# Altium schematic sheet ADC_Mod_1.SchDoc
size Letter
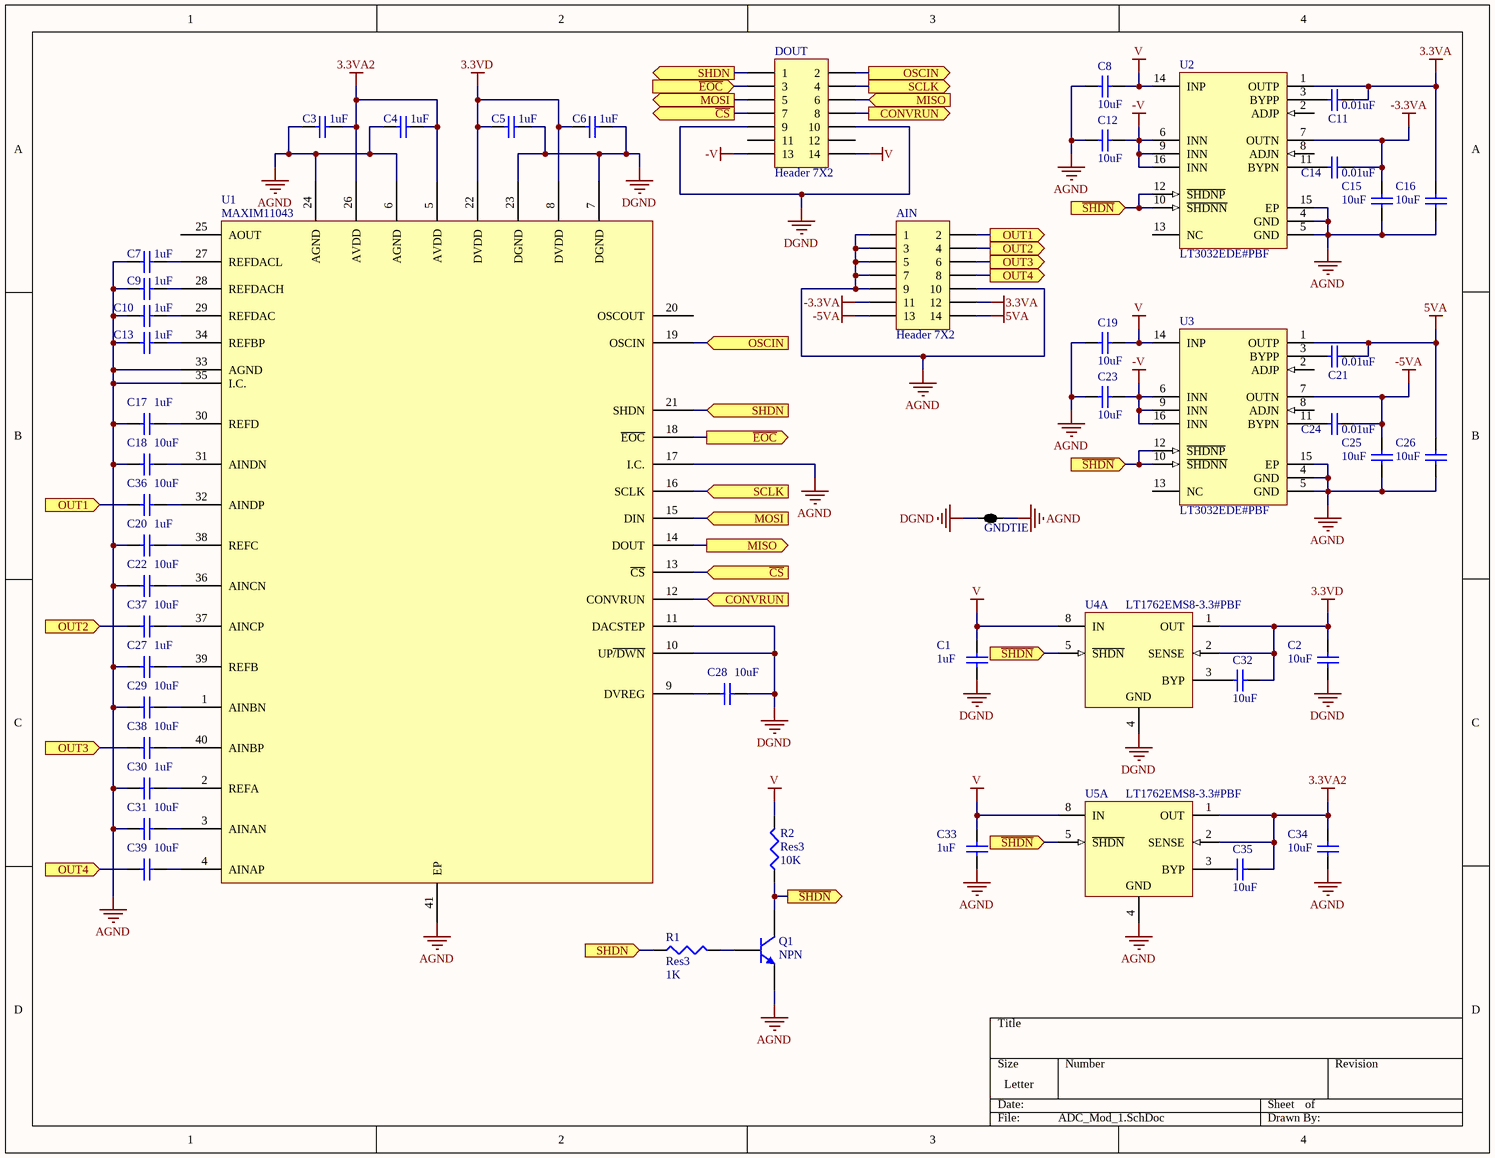
[diagram p0: ADC_Mod_1.SchDoc]

## Parts
AIN  Header 7X2  [CLP-107-02-L-DH-TR]
C1  value 1uF  [0402]  (hidden comment: Cap)
C2  value 10uF  [0402]  (hidden comment: Cap)
C3  value 1uF  [0402]  (hidden comment: Cap)
C4  value 1uF  [0402]  (hidden comment: Cap)
C5  value 1uF  [0402]  (hidden comment: Cap)
C6  value 1uF  [0402]  (hidden comment: Cap)
C7  value 1uF  [0402]  (hidden comment: Cap)
C8  value 10uF  [0402]  (hidden comment: Cap)
C9  value 1uF  [0402]  (hidden comment: Cap)
C10  value 1uF  [0402]  (hidden comment: Cap)
C11  value 0.01uF  [0402]  (hidden comment: Cap)
C12  value 10uF  [0402]  (hidden comment: Cap)
C13  value 1uF  [0402]  (hidden comment: Cap)
C14  value 0.01uF  [0402]  (hidden comment: Cap)
C15  value 10uF  [0402]  (hidden comment: Cap)
C16  value 10uF  [0402]  (hidden comment: Cap)
C17  value 1uF  [0402]  (hidden comment: Cap)
C18  value 10uF  [0402]  (hidden comment: Cap)
C19  value 10uF  [0402]  (hidden comment: Cap)
C20  value 1uF  [0402]  (hidden comment: Cap)
C21  value 0.01uF  [0402]  (hidden comment: Cap)
C22  value 10uF  [0402]  (hidden comment: Cap)
C23  value 10uF  [0402]  (hidden comment: Cap)
C24  value 0.01uF  [0402]  (hidden comment: Cap)
C25  value 10uF  [0402]  (hidden comment: Cap)
C26  value 10uF  [0402]  (hidden comment: Cap)
C27  value 1uF  [0402]  (hidden comment: Cap)
C28  value 10uF  [0402]  (hidden comment: Cap)
C29  value 10uF  [0402]  (hidden comment: Cap)
C30  value 1uF  [0402]  (hidden comment: Cap)
C31  value 10uF  [0402]  (hidden comment: Cap)
C32  value 10uF  [0402]  (hidden comment: Cap)
C33  value 1uF  [0402]  (hidden comment: Cap)
C34  value 10uF  [0402]  (hidden comment: Cap)
C35  value 10uF  [0402]  (hidden comment: Cap)
C36  value 10uF  [0402]  (hidden comment: Cap)
C37  value 10uF  [0402]  (hidden comment: Cap)
C38  value 10uF  [0402]  (hidden comment: Cap)
C39  value 10uF  [0402]  (hidden comment: Cap)
DOUT  Header 7X2  [FTSH-107-01-L-DH]
GNDTIE  2 way net tie junction  [2way_LP]  (value not drawn)  (net tie, no BOM)
Q1  NPN  [SOT23_L]
R1  Res3  value 1K  [J1-0603]
R2  Res3  value 10K  [J1-0603]
U1  MAXIM11043  [QFN50P600X600X80_HS-41N]
U2  LT3032EDE#PBF  [LT-DE14MA-14_V]
U3  LT3032EDE#PBF  [LT-DE14MA-14_V]
U4  LT1762EMS8-3.3#PBF  [LT-MS8_N]  (part A of 2)
U5  LT1762EMS8-3.3#PBF  [LT-MS8_N]  (part A of 2)

## Ports
CONVRUN (in), CONVRUN (out), MISO (in), MISO (out), MOSI (in), MOSI (out), OSCIN (in), OSCIN (out), OUT1 (in), OUT1 (out), OUT2 (in), OUT2 (out), OUT3 (in), OUT3 (out), OUT4 (in), OUT4 (out), SCLK (in), SCLK (out), SHDN (in), SHDN (out), ~{CS} (in), ~{CS} (out), ~{EOC} (in), ~{EOC} (out), ~{SHDN} (in), ~{SHDN} (out)

## Nets
3.3VA: AIN.12 C11.2 C16.2 U2.1(OUTP)
3.3VA2: C3.2 C4.2 C34.2 C35.1 U1.5(AVDD) U1.26(AVDD) U5.1(OUT) U5.2(SENSE)
3.3VD: C2.2 C5.1 C6.1 C32.1 U1.8(DVDD) U1.22(DVDD) U4.1(OUT) U4.2(SENSE)
5VA: AIN.14 C21.2 C26.2 U3.1(OUTP)
-3.3VA: AIN.11 C14.2 C15.2 U2.7(OUTN)
-5VA: AIN.13 C24.2 C25.2 U3.7(OUTN)
-V: C12.1 C23.1 DOUT.13 U2.6(INN) U2.9(INN) U2.16(INN) U3.6(INN) U3.9(INN) U3.16(INN)
AGND: AIN.1 AIN.3 AIN.5 AIN.7 AIN.9 AIN.10 C3.1 C4.1 C7.1 C8.2 C9.1 C10.1 C12.2 C13.1 C15.1 C16.1 C17.1 C18.1 C19.2 C20.1 C22.1 C23.2 C25.1 C26.1 C27.1 C29.1 C30.1 C31.1 C33.1 C34.1 GNDTIE.2 Q1.3(E) U1.6(AGND) U1.17(I.C.) U1.24(AGND) U1.33(AGND) U1.35(I.C.) U1.41(EP) U2.4(GND) U2.5(GND) U2.15(EP) U3.4(GND) U3.5(GND) U3.15(EP) U5.4(GND)
DGND: C1.1 C2.1 C5.2 C6.2 C28.2 DOUT.9 DOUT.10 GNDTIE.1 U1.7(DGND) U1.10(UP~{/DWN}) U1.11(DACSTEP) U1.23(DGND) U4.4(GND)
V: C1.2 C8.1 C19.1 C33.2 DOUT.14 R2.2 U2.14(INP) U3.14(INP) U4.8(IN) U5.8(IN)
~{CS}: DOUT.7 U1.13(~{CS}) ; port ~{CS}
CONVRUN: DOUT.8 U1.12(CONVRUN) ; port CONVRUN
~{EOC}: DOUT.3 U1.18(~{EOC}) ; port ~{EOC}
MISO: DOUT.6 U1.14(DOUT) ; port MISO
MOSI: DOUT.5 U1.15(DIN) ; port MOSI
OSCIN: DOUT.2 U1.19(OSCIN) ; port OSCIN
OUT1: AIN.2 C36.1 ; port OUT1
OUT2: AIN.4 C37.1 ; port OUT2
OUT3: AIN.6 C38.1 ; port OUT3
OUT4: AIN.8 C39.1 ; port OUT4
~{SHDN}: Q1.1(C) R2.1 U2.10(~{SHDNN}) U2.12(~{SHDNP}) U3.10(~{SHDNN}) U3.12(~{SHDNP}) U4.5(~{SHDN}) U5.5(~{SHDN}) ; port ~{SHDN}
SCLK: DOUT.4 U1.16(SCLK) ; port SCLK
SHDN: DOUT.1 R1.1 U1.21(SHDN) ; port SHDN
NetC7_2: C7.2 U1.27(REFDACL)
NetC9_2: C9.2 U1.28(REFDACH)
NetC10_2: C10.2 U1.29(REFDAC)
NetC11_1: C11.1 U2.3(BYPP)
NetC13_2: C13.2 U1.34(REFBP)
NetC14_1: C14.1 U2.11(BYPN)
NetC17_2: C17.2 U1.30(REFD)
NetC18_2: C18.2 U1.31(AINDN)
NetC20_2: C20.2 U1.38(REFC)
NetC21_1: C21.1 U3.3(BYPP)
NetC22_2: C22.2 U1.36(AINCN)
NetC24_1: C24.1 U3.11(BYPN)
NetC27_2: C27.2 U1.39(REFB)
NetC28_1: C28.1 U1.9(DVREG)
NetC29_2: C29.2 U1.1(AINBN)
NetC30_2: C30.2 U1.2(REFA)
NetC31_2: C31.2 U1.3(AINAN)
NetC32_2: C32.2 U4.3(BYP)
NetC35_2: C35.2 U5.3(BYP)
NetC36_2: C36.2 U1.32(AINDP)
NetC37_2: C37.2 U1.37(AINCP)
NetC38_2: C38.2 U1.40(AINBP)
NetC39_2: C39.2 U1.4(AINAP)
NetQ1_2: Q1.2(B) R1.2

Not connected (* = marked no-connect by the designer): DOUT 11 12; U1 20(OSCOUT) 25(AOUT); U2 2(ADJP) 8(ADJN) 13(NC); U3 2(ADJP) 8(ADJN) 13(NC)

## Library data of the parts
AIN DOUT = Header 7X2: Header, 7-Pin, Dual row; System: Connector; LatestRevisionDate: 17-Jul-2002; LatestRevisionNote: Re-released for DXP Platform.; Publisher: Altium Limited
C1-C39 = Cap: Capacitor; Published: 8-Jun-2000; LatestRevisionDate: 17-Jul-2002; LatestRevisionNote: Re-released for DXP Platform.; PackageReference: RAD-0.3; Publisher: Altium Limited; PackageDescription: Radial Cap, Thru-Hole; 2 Leads; 0.3 in Pin Spacing
GNDTIE = 2way: ComponentLink1URL: http://www.edatools.cz/addons; ComponentLink1Description: Source; FootprintNote: LP=12mil, MP=40mil, HP=120mil
Q1 = NPN: NPN Bipolar Transistor; Published: 8-Jun-2000; LatestRevisionDate: 17-Jul-2002; LatestRevisionNote: Re-released for DXP Platform.; PackageReference: TO-226-AA; Publisher: Altium Limited; PackageDescription: TO, Flat Index; 3 In-Line, Axial Leads; Body Dia. 4.8mm; Leads 0.55 x 0.51 mm (max); Code_JEDEC: TO-226-AA
R1 R2 = Res3: Resistor; Published: 8-Jun-2000; LatestRevisionDate: 29-May-2009; LatestRevisionNote: IPC-7351 Footprint Added.; PackageReference: J1-0603; Publisher: Altium Limited; PackageDescription: Chip Resistor
U2 U3 = LT3032EDE#PBF: Dual 150 mA Positive / Negative Low Noise Low Dropout Linear Regulator, +/-2.3 to +/-20 V Vin, Adjustable Vout, 14-pin SON (DE14MA-14), -40 to 125 degC, Pb-Free; Manufacturer: Linear Technology; Discrete Pass Element: no; Dropout Voltage(V): 0.3; Iout(mA): 150; Isupply(mA): 0.025; Noise(uV): 30; Number of Outputs: 2; Output Voltage: Adj,-Adj; PSRR(dB): 68; Shutdown Current(uA): 0.1; Vout Min(V): +/-1.22; DatasheetVersion: Rev. D; PackageVersion: Rev. A, 06/2010; PackageReference: DE14MA-14; PackageDescription: 14-Pin Plastic DFN, Body 4 x 3 mm, Pitch 0.5 mm; Supplier 1: Digi-Key; Supplier Part Number 1: LT3032EDE#PBF-ND; Supplier 2: Farnell; Supplier Part Number 2: 2289423; Supplier 3: Newark; Supplier Part Number 3: 52R9875; RoHS: TRUE; Vin Max(V): +/-20; Vin Min(V): +/-2.3; Vout Max(V): +/-20; Mounting Technology: Surface Mount; PartNumber: LT3032EDE#PBF; ComponentLink1Description: Manufacturer URL; ComponentLink1URL: http://www.linear.com/; ComponentLink2Description: Datasheet; ComponentLink2URL: http://cds.linear.com/docs/en/datasheet/3032fd.pdf; ComponentLink3Description: Package Specification; ComponentLink3URL: http://cds.linear.com/docs/en/packaging/DFN_14_05-08-1731.pdf
U4 U5 = LT1762EMS8-3.3#PBF: 150 mA, Low Noise, LDO Micropower Regulator, 1.8 to 20 V Vin, 3.3 V Vout, 8-pin SOP (MS8-8), -40 to 125 degC, Pb-Free; Manufacturer: Linear Technology; Discrete Pass Element: no; Dropout Voltage(V): 0.27; Iout(mA): 150; Isupply(mA): 0.025; Noise(uV): 20; Number of Outputs: 1; Output Voltage: 3.3 V; PSRR(dB): 65; Vin Min(V): 1.8; DatasheetVersion: Rev. A; PackageVersion: Rev. G, 05/2013; PackageReference: MS8; PackageDescription: 8-Pin Plastic MSOP, Body 3 x 3 mm, Pitch 0.65 mm; Supplier 1: Digi-Key; Supplier Part Number 1: LT1762EMS8-3.3#PBF-ND; Supplier 2: Farnell; Supplier Part Number 2: 1273611; Supplier 3: Newark; Supplier Part Number 3: 57M6001; RoHS: TRUE; Shutdown Current(uA): 1; Vin Max(V): 20; Mounting Technology: Surface Mount; PartNumber: LT1762EMS8-3.3#PBF; ComponentLink1Description: Manufacturer URL; ComponentLink1URL: http://www.linear.com/; ComponentLink2Description: Datasheet; ComponentLink2URL: http://cds.linear.com/docs/en/datasheet/1762fa.pdf; ComponentLink3Description: Package Specification; ComponentLink3URL: http://cds.linear.com/docs/en/packaging/05081660_G_MS8.pdf